# EAGLE design harpscheme (EAGLE 7.7.0)
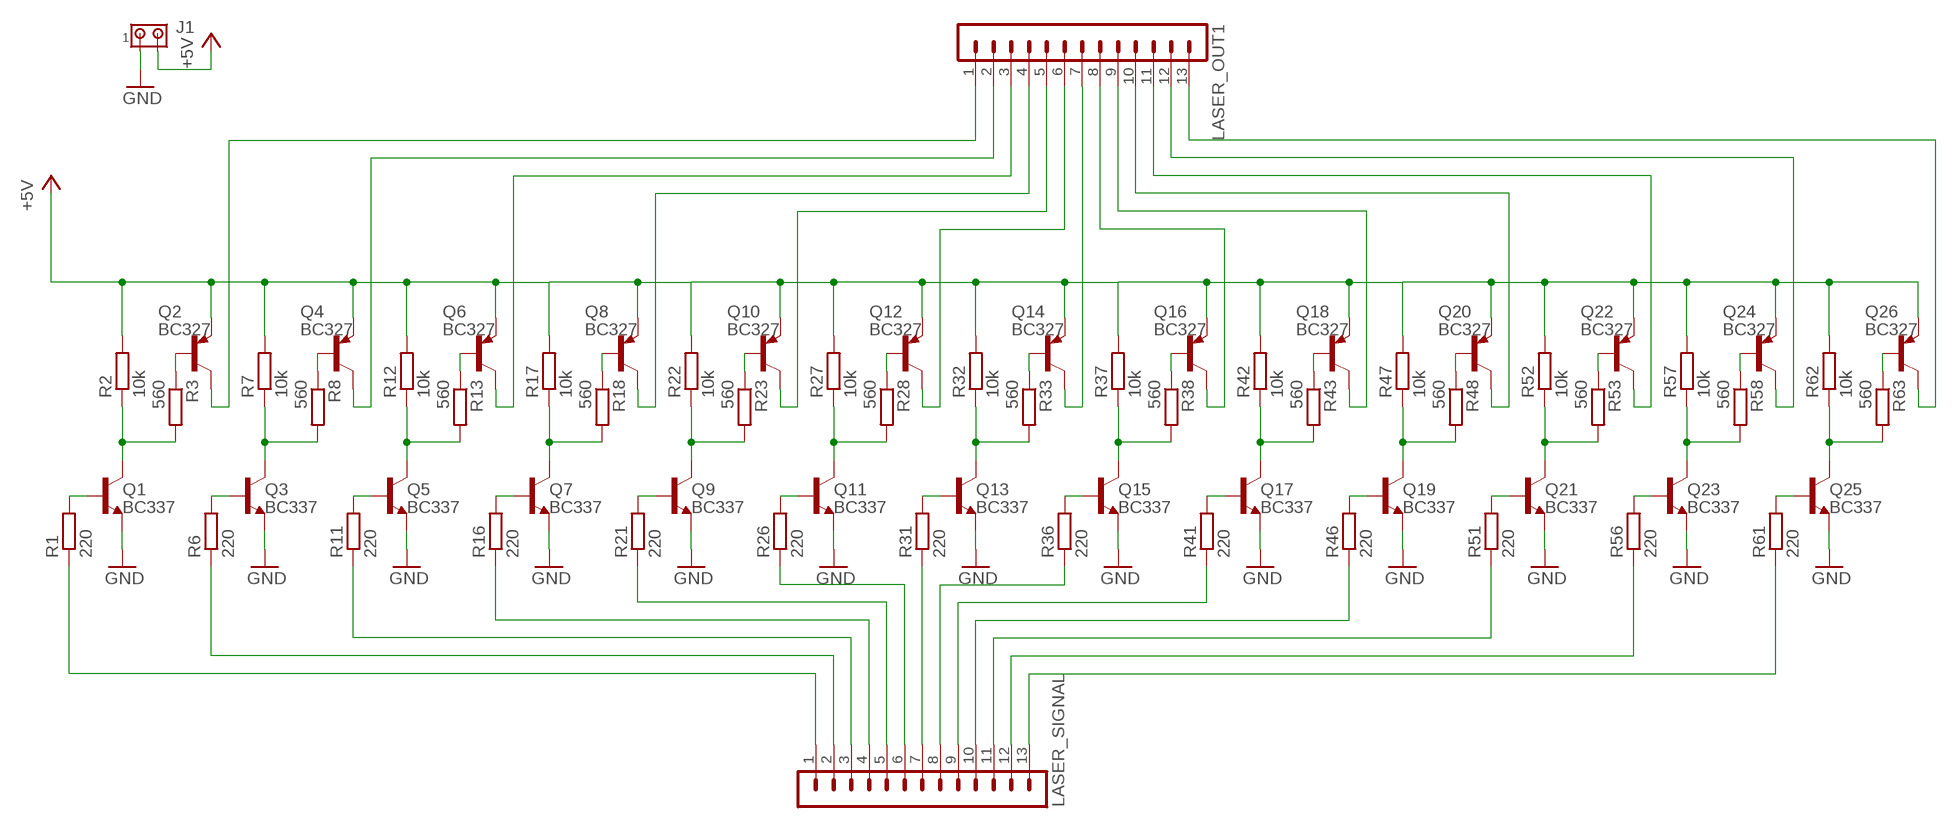
[diagram p0: schematic, sheet 1]

## Parts
J1  MTA02-100  [10X02MTA]
LASER_OUT1  MA13-1  [MA13-1]
LASER_SIGNAL  MA13-1  [MA13-1]
Q1  BC337  [TO92]
Q2  BC327  [TO92-EBC]
Q3  BC337  [TO92]
Q4  BC327  [TO92-EBC]
Q5  BC337  [TO92]
Q6  BC327  [TO92-EBC]
Q7  BC337  [TO92]
Q8  BC327  [TO92-EBC]
Q9  BC337  [TO92]
Q10  BC327  [TO92-EBC]
Q11  BC337  [TO92]
Q12  BC327  [TO92-EBC]
Q13  BC337  [TO92]
Q14  BC327  [TO92-EBC]
Q15  BC337  [TO92]
Q16  BC327  [TO92-EBC]
Q17  BC337  [TO92]
Q18  BC327  [TO92-EBC]
Q19  BC337  [TO92]
Q20  BC327  [TO92-EBC]
Q21  BC337  [TO92]
Q22  BC327  [TO92-EBC]
Q23  BC337  [TO92]
Q24  BC327  [TO92-EBC]
Q25  BC337  [TO92]
Q26  BC327  [TO92-EBC]
R1  220  R-EU_0207/7  [0207/7]
R2  10k  R-EU_0207/7  [0207/7]
R3  560  R-EU_0207/7  [0207/7]
R6  220  R-EU_0207/7  [0207/7]
R7  10k  R-EU_0207/7  [0207/7]
R8  560  R-EU_0207/7  [0207/7]
R11  220  R-EU_0207/7  [0207/7]
R12  10k  R-EU_0207/7  [0207/7]
R13  560  R-EU_0207/7  [0207/7]
R16  220  R-EU_0207/7  [0207/7]
R17  10k  R-EU_0207/7  [0207/7]
R18  560  R-EU_0207/7  [0207/7]
R21  220  R-EU_0207/7  [0207/7]
R22  10k  R-EU_0207/7  [0207/7]
R23  560  R-EU_0207/7  [0207/7]
R26  220  R-EU_0207/7  [0207/7]
R27  10k  R-EU_0207/7  [0207/7]
R28  560  R-EU_0207/7  [0207/7]
R31  220  R-EU_0207/7  [0207/7]
R32  10k  R-EU_0207/7  [0207/7]
R33  560  R-EU_0207/7  [0207/7]
R36  220  R-EU_0207/7  [0207/7]
R37  10k  R-EU_0207/7  [0207/7]
R38  560  R-EU_0207/7  [0207/7]
R41  220  R-EU_0207/7  [0207/7]
R42  10k  R-EU_0207/7  [0207/7]
R43  560  R-EU_0207/7  [0207/7]
R46  220  R-EU_0207/7  [0207/7]
R47  10k  R-EU_0207/7  [0207/7]
R48  560  R-EU_0207/7  [0207/7]
R51  220  R-EU_0207/7  [0207/7]
R52  10k  R-EU_0207/7  [0207/7]
R53  560  R-EU_0207/7  [0207/7]
R56  220  R-EU_0207/7  [0207/7]
R57  10k  R-EU_0207/7  [0207/7]
R58  560  R-EU_0207/7  [0207/7]
R61  220  R-EU_0207/7  [0207/7]
R62  10k  R-EU_0207/7  [0207/7]
R63  560  R-EU_0207/7  [0207/7]

## Nets
+5V: J1.2 Q2.E Q4.E Q6.E Q8.E Q10.E Q12.E Q14.E Q16.E Q18.E Q20.E Q22.E Q24.E Q26.E R2.2 R7.2 R12.2 R17.2 R22.2 R27.2 R32.2 R37.2 R42.2 R47.2 R52.2 R57.2 R62.2
GND: J1.1 Q1.1(E) Q3.1(E) Q5.1(E) Q7.1(E) Q9.1(E) Q11.1(E) Q13.1(E) Q15.1(E) Q17.1(E) Q19.1(E) Q21.1(E) Q23.1(E) Q25.1(E)
N$1: Q1.2(B) R1.2
N$2: Q1.3(C) R2.1 R3.2
N$3: Q2.B R3.1
N$4: LASER_SIGNAL.7 R31.1
N$6: LASER_OUT1.1 Q2.C
N$7: Q3.2(B) R6.2
N$8: Q3.3(C) R7.1 R8.2
N$9: Q4.B R8.1
N$12: LASER_OUT1.2 Q4.C
N$13: Q5.2(B) R11.2
N$14: Q5.3(C) R12.1 R13.2
N$15: Q6.B R13.1
N$17: LASER_SIGNAL.6 R26.1
N$18: LASER_OUT1.3 Q6.C
N$19: Q7.2(B) R16.2
N$20: Q7.3(C) R17.1 R18.2
N$21: Q8.B R18.1
N$23: LASER_SIGNAL.5 R21.1
N$24: LASER_OUT1.4 Q8.C
N$25: Q9.2(B) R21.2
N$26: Q9.3(C) R22.1 R23.2
N$27: Q10.B R23.1
N$29: LASER_SIGNAL.4 R16.1
N$30: LASER_OUT1.5 Q10.C
N$31: Q11.2(B) R26.2
N$32: Q11.3(C) R27.1 R28.2
N$33: Q12.B R28.1
N$35: LASER_SIGNAL.3 R11.1
N$36: LASER_OUT1.6 Q12.C
N$37: Q13.2(B) R31.2
N$38: Q13.3(C) R32.1 R33.2
N$39: Q14.B R33.1
N$41: LASER_SIGNAL.2 R6.1
N$42: LASER_OUT1.7 Q14.C
N$43: Q15.2(B) R36.2
N$44: Q15.3(C) R37.1 R38.2
N$45: Q16.B R38.1
N$47: LASER_SIGNAL.1 R1.1
N$48: LASER_OUT1.8 Q16.C
N$49: Q17.2(B) R41.2
N$50: Q17.3(C) R42.1 R43.2
N$51: Q18.B R43.1
N$53: LASER_SIGNAL.8 R36.1
N$54: LASER_OUT1.9 Q18.C
N$55: Q19.2(B) R46.2
N$56: Q19.3(C) R47.1 R48.2
N$57: Q20.B R48.1
N$59: LASER_SIGNAL.9 R41.1
N$60: LASER_OUT1.10 Q20.C
N$61: Q21.2(B) R51.2
N$62: Q21.3(C) R52.1 R53.2
N$63: Q22.B R53.1
N$65: LASER_SIGNAL.10 R46.1
N$66: LASER_OUT1.11 Q22.C
N$67: Q23.2(B) R56.2
N$68: Q23.3(C) R57.1 R58.2
N$69: Q24.B R58.1
N$71: LASER_SIGNAL.11 R51.1
N$72: LASER_OUT1.12 Q24.C
N$73: Q25.2(B) R61.2
N$74: Q25.3(C) R62.1 R63.2
N$75: Q26.B R63.1
N$77: LASER_SIGNAL.12 R56.1
N$78: LASER_OUT1.13 Q26.C
N$79: LASER_SIGNAL.13 R61.1

## Library data of the parts
J1 = con-amp:MTA02-100: AMP connector
LASER_OUT1 LASER_SIGNAL = con-lstb:MA13-1: PIN HEADER; OC_FARNELL: unknown; OC_NEWARK: unknown
Q1 Q3 Q5 Q7 Q9 Q11 Q13 Q15 Q17 Q19 Q21 Q23 Q25 = transistor-npn:BC337*: NPN Transistor
Q2 Q4 Q6 Q8 Q10 Q12 Q14 Q16 Q18 Q20 Q22 Q24 Q26 = transistor-pnp:BC327*: PNP Transistror
R1-R3 R6-R8 R11-R13 R16-R18 R21-R23 R26-R28 R31-R33 R36-R38 R41-R43 R46-R48 R51-R53 R56-R58 R61-R63 = resistor:R-EU_: RESISTOR, European symbol

## Board
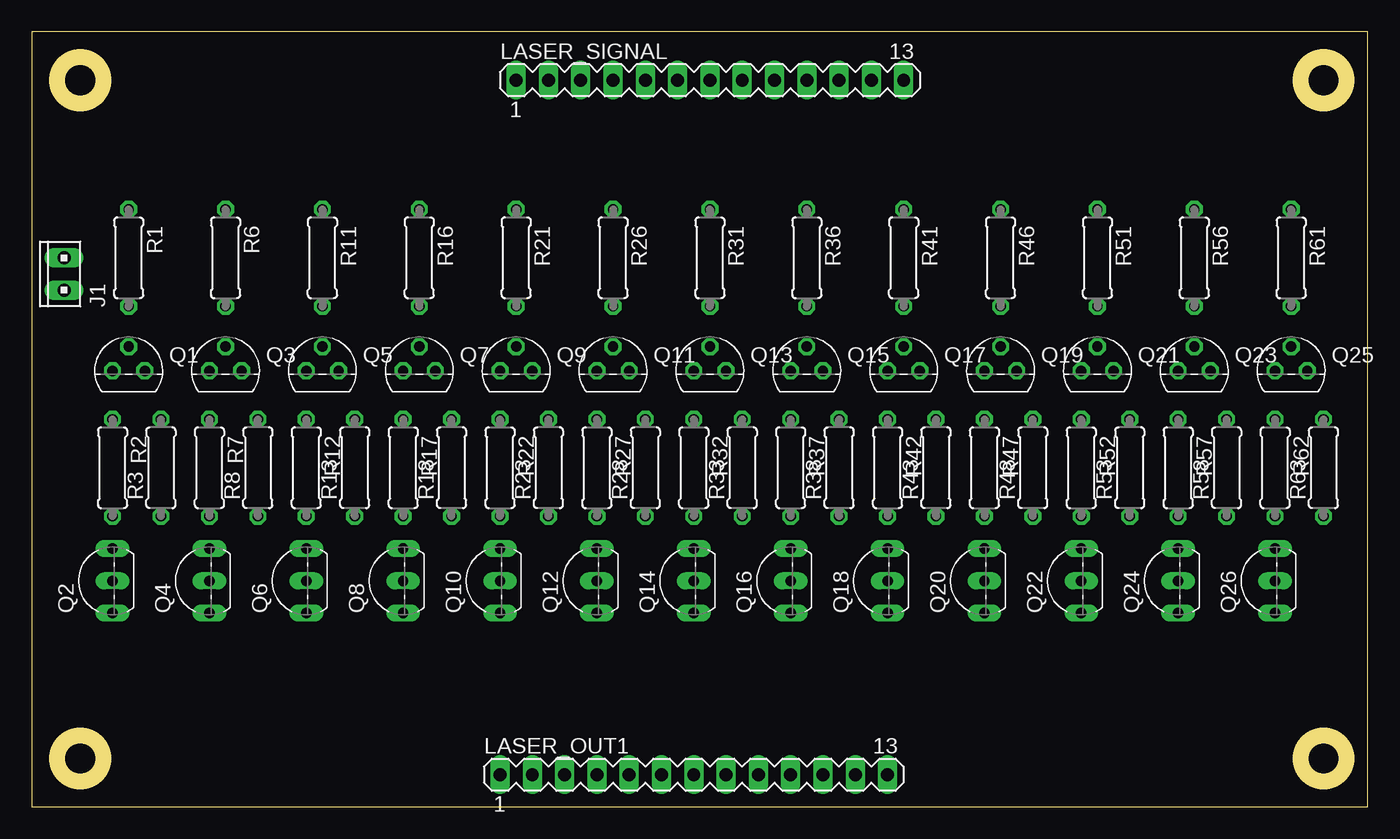
[diagram p1: board, top side]
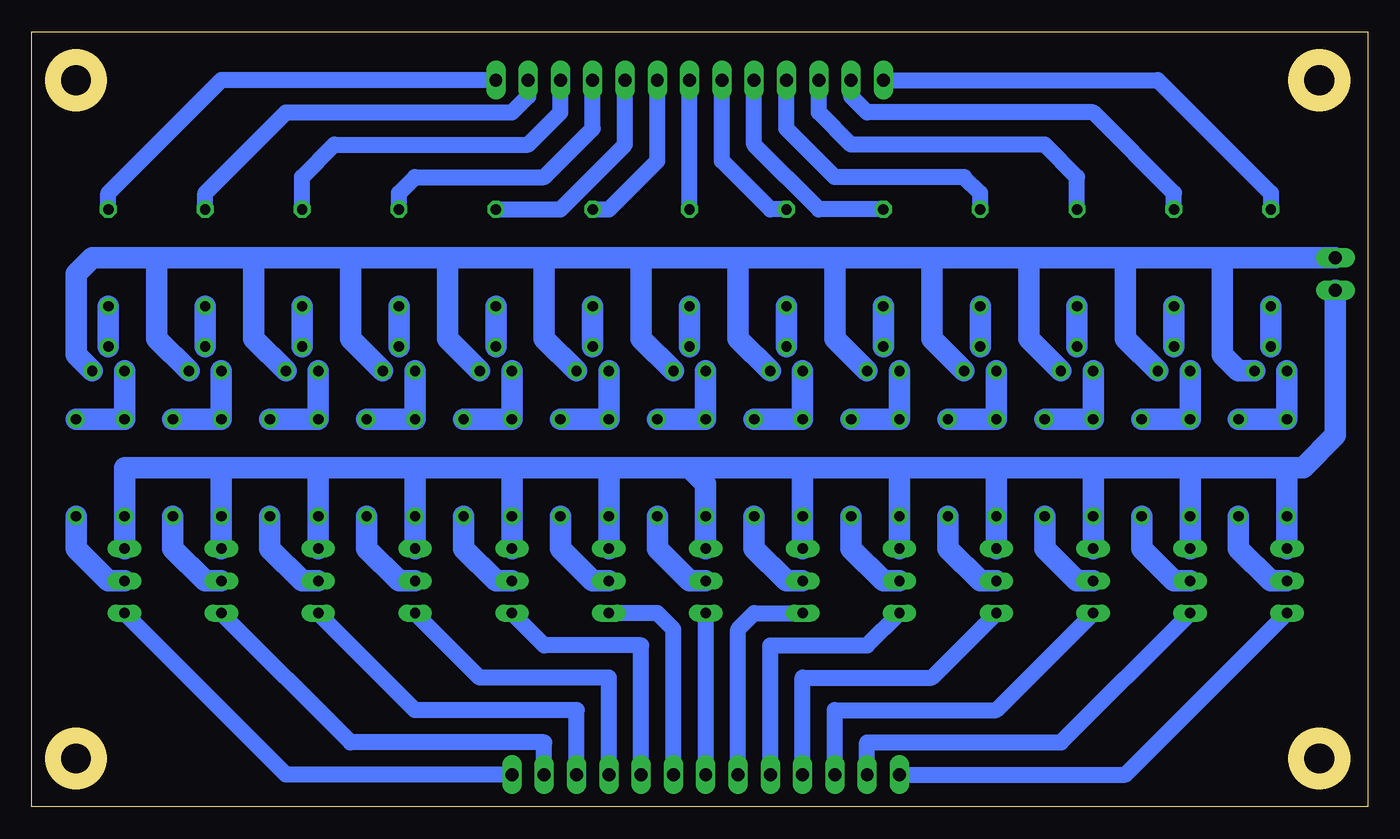
[diagram p2: board, bottom side, seen from below]

Size 105.08 x 60.95 mm. Coordinates in mm from the lower left corner, seen from the top.
Outline: 0,0 105.08,0 105.08,60.95 0,60.95 0,0
Outline: circle at 3.81,57.15 radius 1.8
Outline: circle at 3.81,3.81 radius 1.8
Outline: circle at 101.6,3.81 radius 1.8
Outline: circle at 101.6,57.15 radius 1.8
Copper layers (1*16): Top 0.035mm / dielectric 1.5mm / Bottom 0.035mm
Design rules "default": minimum track width 10mil, minimum drill 24mil, track to track 8mil, track to pad 8mil, pad to pad 8mil, via to via 8mil, smd to smd 8mil, copper to edge 40mil, drill to drill 8mil, minimum pad ring 10mil, minimum via ring 8mil, stop-mask expansion 4mil, vias tented up to drill 0mil, thermal gap 10mil

### Footprints (pad centres in the part's own frame; a part is rotated, then mirrored left to right if it is on the bottom)
10X02MTA = drill 1.016 long: 1 1.27,0; 2 -1.27,0
MA13-1 = drill 1.016 long: 1 -15.24,0; 2 -12.7,0; 3 -10.16,0; 4 -7.62,0; 5 -5.08,0; 6 -2.54,0; 7 0,0; 8 2.54,0; 9 5.08,0; 10 7.62,0; 11 10.16,0; 12 12.7,0; 13 15.24,0
TO92 = drill 0.813 octagon: 1 1.27,0; 2 0,1.905; 3 -1.27,0
TO92-EBC = drill 0.813 long: B 0,-1.27; C -2.54,-1.27; E 2.54,-1.27
0207/7 = drill 0.813 octagon: 1 -3.81,0; 2 3.81,0

### Placement (x,y rotation side)
J1  2.54,41.91 90 top
LASER_OUT1  52.07,2.54 0 top
LASER_SIGNAL  53.34,57.15 0 top
Q1  7.62,34.29 0 top
Q2  5.08,17.78 90 top
Q3  15.24,34.29 0 top
Q4  12.7,17.78 90 top
Q5  22.86,34.29 0 top
Q6  20.32,17.78 90 top
Q7  30.48,34.29 0 top
Q8  27.94,17.78 90 top
Q9  38.1,34.29 0 top
Q10  35.56,17.78 90 top
Q11  45.72,34.29 0 top
Q12  43.18,17.78 90 top
Q13  53.34,34.29 0 top
Q14  50.8,17.78 90 top
Q15  60.96,34.29 0 top
Q16  58.42,17.78 90 top
Q17  68.58,34.29 0 top
Q18  66.04,17.78 90 top
Q19  76.2,34.29 0 top
Q20  73.66,17.78 90 top
Q21  83.82,34.29 0 top
Q22  81.28,17.78 90 top
Q23  91.44,34.29 0 top
Q24  88.9,17.78 90 top
Q25  99.06,34.29 0 top
Q26  96.52,17.78 90 top
R1  7.62,43.18 270 top
R2  6.35,26.67 270 top
R3  10.16,26.67 90 top
R6  15.24,43.18 270 top
R7  13.97,26.67 270 top
R8  17.78,26.67 90 top
R11  22.86,43.18 270 top
R12  21.59,26.67 270 top
R13  25.4,26.67 90 top
R16  30.48,43.18 270 top
R17  29.21,26.67 270 top
R18  33.02,26.67 90 top
R21  38.1,43.18 270 top
R22  36.83,26.67 270 top
R23  40.64,26.67 90 top
R26  45.72,43.18 270 top
R27  44.45,26.67 270 top
R28  48.26,26.67 90 top
R31  53.34,43.18 270 top
R32  52.07,26.67 270 top
R33  55.88,26.67 90 top
R36  60.96,43.18 270 top
R37  59.69,26.67 270 top
R38  63.5,26.67 90 top
R41  68.58,43.18 270 top
R42  67.31,26.67 270 top
R43  71.12,26.67 90 top
R46  76.2,43.18 270 top
R47  74.93,26.67 270 top
R48  78.74,26.67 90 top
R51  83.82,43.18 270 top
R52  82.55,26.67 270 top
R53  86.36,26.67 90 top
R56  91.44,43.18 270 top
R57  90.17,26.67 270 top
R58  93.98,26.67 90 top
R61  99.06,43.18 270 top
R62  97.79,26.67 270 top
R63  101.6,26.67 90 top

### Tracks (layer width: path | path; a pad name or v marks a point on that pad's centre or on a via)
+5V
  Bottom 1.676: Q2.E R2.2 6.35,26.67 | Q4.E R7.2 13.97,26.67 | Q6.E R12.2 21.59,26.67 | Q8.E R17.2 29.21,26.67 | Q10.E R22.2 36.83,26.67 | Q12.E R27.2 44.45,26.67 | Q14.E R32.2 52.07,25.4 53.34,26.67 | Q16.E R37.2 59.69,26.67 | Q18.E R42.2 67.31,26.67 | Q20.E R47.2 74.93,26.67 | Q22.E R52.2 82.55,26.67 | R57.2 Q24.E 90.17,26.67 | Q26.E R62.2 97.79,26.67 90.17,26.67 | 6.35,26.67 13.97,26.67 | 13.97,26.67 21.59,26.67 | 21.59,26.67 29.21,26.67 | 29.21,26.67 36.83,26.67 | 36.83,26.67 44.45,26.67 | 44.45,26.67 53.34,26.67 | 53.34,26.67 59.69,26.67 | 59.69,26.67 67.31,26.67 | 67.31,26.67 74.93,26.67 | 74.93,26.67 82.55,26.67 | 82.55,26.67 90.17,26.67 | 6.35,26.67 5.08,26.67 2.54,29.21 J1.2
GND
  Bottom 1.676: Q1.1 10.16,34.29 11.43,35.56 11.43,43.18 | 11.43,43.18 19.05,43.18 | 19.05,43.18 26.67,43.18 | 26.67,43.18 34.29,43.18 | 34.29,43.18 41.91,43.18 | 41.91,43.18 49.53,43.18 | 49.53,43.18 57.15,43.18 | 57.15,43.18 64.77,43.18 | 64.77,43.18 72.39,43.18 | 72.39,43.18 80.01,43.18 | 80.01,43.18 87.63,43.18 | 87.63,43.18 95.25,43.18 | 95.25,43.18 100.33,43.18 101.6,41.91 101.6,35.56 Q25.1 | Q3.1 19.05,36.83 19.05,43.18 | Q5.1 26.67,36.83 26.67,43.18 | Q7.1 34.29,36.83 34.29,43.18 | Q9.1 41.91,36.83 41.91,43.18 | Q11.1 49.53,36.83 49.53,43.18 | Q13.1 57.15,36.83 57.15,43.18 | Q15.1 64.77,36.83 64.77,43.18 | Q17.1 72.39,36.83 72.39,43.18 | Q19.1 80.01,36.83 80.01,43.18 | Q21.1 87.63,36.83 87.63,43.18 | Q23.1 95.25,36.83 95.25,43.18 | J1.1 11.43,43.18
N$1
  Bottom 1.676: Q1.2 R1.2
N$2
  Bottom 1.676: R3.2 R2.1 Q1.3
N$3
  Bottom 1.676: Q2.B 7.62,17.78 10.16,20.32 R3.1
N$4
  Bottom 1.27: R31.1 LASER_SIGNAL.7
N$6
  Bottom 1.27: LASER_OUT1.1 19.05,2.54 Q2.C
N$7
  Bottom 1.676: R6.2 Q3.2
N$8
  Bottom 1.676: R8.2 R7.1 Q3.3
N$9
  Bottom 1.676: Q4.B 15.24,17.78 17.78,20.32 R8.1
N$12
  Bottom 1.27: LASER_OUT1.2 39.37,5.08 24.13,5.08 Q4.C
N$13
  Bottom 1.676: Q5.2 R11.2
N$14
  Bottom 1.676: R13.2 R12.1 Q5.3
N$15
  Bottom 1.676: Q6.B 22.86,17.78 25.4,20.32 R13.1
N$17
  Bottom 1.27: R26.1 46.99,46.99 50.8,50.8 LASER_SIGNAL.6
N$18
  Bottom 1.27: LASER_OUT1.3 41.91,7.62 29.21,7.62 Q6.C
N$19
  Bottom 1.676: Q7.2 R16.2
N$20
  Bottom 1.676: R18.2 R17.1 Q7.3
N$21
  Bottom 1.676: Q8.B 30.48,17.78 33.02,20.32 R18.1
N$23
  Bottom 1.27: R21.1 43.18,46.99 48.26,52.07 LASER_SIGNAL.5
N$24
  Bottom 1.27: LASER_OUT1.4 44.45,10.16 34.29,10.16 Q8.C
N$25
  Bottom 1.676: Q9.2 R21.2
N$26
  Bottom 1.676: R23.2 R22.1 Q9.3
N$27
  Bottom 1.676: Q10.B 38.1,17.78 40.64,20.32 R23.1
N$29
  Bottom 1.27: R16.1 30.48,48.26 31.75,49.53 41.91,49.53 45.72,53.34 LASER_SIGNAL.4
N$30
  Bottom 1.27: LASER_OUT1.5 46.99,12.7 39.37,12.7 Q10.C
N$31
  Bottom 1.676: Q11.2 R26.2
N$32
  Bottom 1.676: R28.2 R27.1 Q11.3
N$33
  Bottom 1.676: Q12.B 45.72,17.78 48.26,20.32 R28.1
N$35
  Bottom 1.27: R11.1 22.86,49.53 25.4,52.07 40.64,52.07 43.18,54.61 LASER_SIGNAL.3
N$36
  Bottom 1.27: LASER_OUT1.6 49.53,13.97 48.26,15.24 Q12.C
N$37
  Bottom 1.676: Q13.2 R31.2
N$38
  Bottom 1.676: R33.2 R32.1 Q13.3
N$39
  Bottom 1.676: Q14.B 53.34,17.78 55.88,20.32 R33.1
N$41
  Bottom 1.27: LASER_SIGNAL.2 40.64,55.88 39.37,54.61 21.59,54.61 15.24,48.26 R6.1
N$42
  Bottom 1.27: Q14.C LASER_OUT1.7
N$43
  Bottom 1.676: Q15.2 R36.2
N$44
  Bottom 1.676: R38.2 R37.1 Q15.3
N$45
  Bottom 1.676: Q16.B 60.96,17.78 63.5,20.32 R38.1
N$47
  Bottom 1.27: LASER_SIGNAL.1 16.51,57.15 7.62,48.26 R1.1
N$48
  Bottom 1.27: LASER_OUT1.8 54.61,13.97 55.88,15.24 Q16.C
N$49
  Bottom 1.676: Q17.2 R41.2
N$50
  Bottom 1.676: R43.2 R42.1 Q17.3
N$51
  Bottom 1.676: Q18.B 68.58,17.78 71.12,20.32 R43.1
N$53
  Bottom 1.27: R36.1 59.69,46.99 55.88,50.8 LASER_SIGNAL.8
N$54
  Bottom 1.27: LASER_OUT1.9 57.15,12.7 64.77,12.7 Q18.C
N$55
  Bottom 1.676: Q19.2 R46.2
N$56
  Bottom 1.676: R48.2 R47.1 Q19.3
N$57
  Bottom 1.676: Q20.B 76.2,17.78 78.74,20.32 R48.1
N$59
  Bottom 1.27: R41.1 63.5,46.99 58.42,52.07 LASER_SIGNAL.9
N$60
  Bottom 1.27: LASER_OUT1.10 59.69,10.16 69.85,10.16 Q20.C
N$61
  Bottom 1.676: Q21.2 R51.2
N$62
  Bottom 1.676: R53.2 R52.1 Q21.3
N$63
  Bottom 1.676: Q22.B 83.82,17.78 86.36,20.32 R53.1
N$65
  Bottom 1.27: R46.1 76.2,48.26 74.93,49.53 64.77,49.53 60.96,53.34 LASER_SIGNAL.10
N$66
  Bottom 1.27: LASER_OUT1.11 62.23,7.62 74.93,7.62 Q22.C
N$67
  Bottom 1.676: Q23.2 R56.2
N$68
  Bottom 1.676: R58.2 R57.1 Q23.3
N$69
  Bottom 1.676: Q24.B 91.44,17.78 93.98,20.32 R58.1
N$71
  Bottom 1.27: R51.1 83.82,49.53 81.28,52.07 66.04,52.07 63.5,54.61 LASER_SIGNAL.11
N$72
  Bottom 1.27: LASER_OUT1.12 64.77,5.08 80.01,5.08 Q24.C
N$73
  Bottom 1.676: Q25.2 R61.2
N$74
  Bottom 1.676: R63.2 R62.1 Q25.3
N$75
  Bottom 1.676: Q26.B 99.06,17.78 101.6,20.32 R63.1
N$77
  Bottom 1.27: R56.1 91.44,48.26 85.09,54.61 67.31,54.61 66.04,55.88 LASER_SIGNAL.12
N$78
  Bottom 1.27: LASER_OUT1.13 85.09,2.54 Q26.C
N$79
  Bottom 1.27: LASER_SIGNAL.13 90.17,57.15 99.06,48.26 R61.1